# Altium schematic sheet MAGIsDebugger.SchDoc
size A4
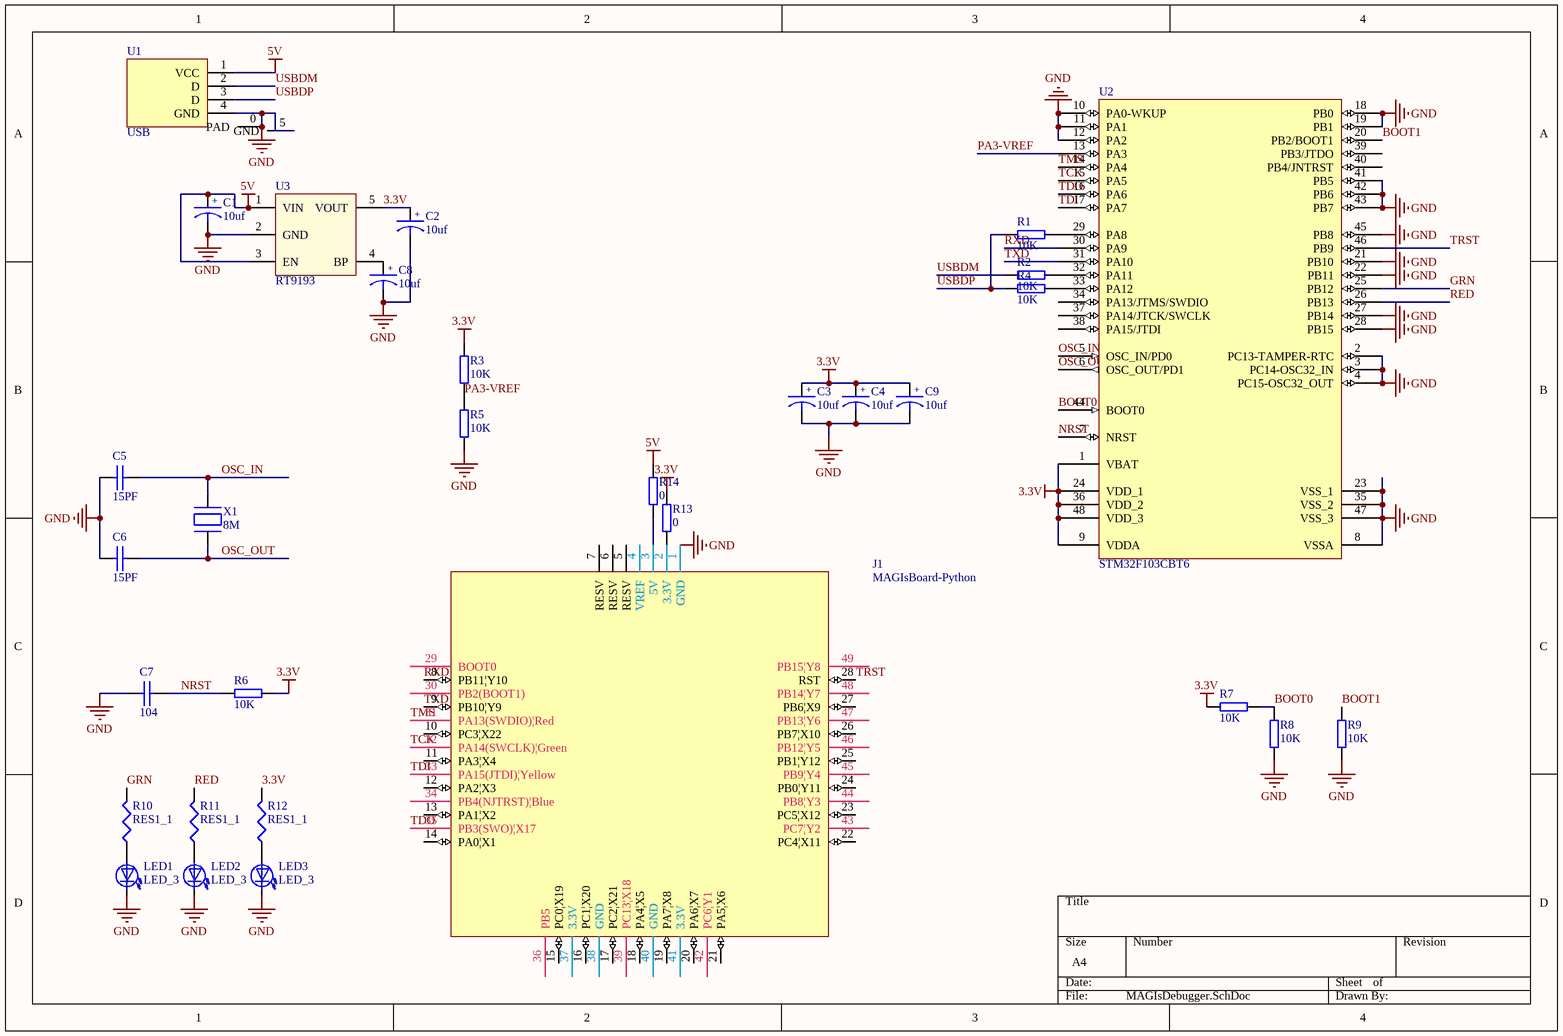
[diagram p0: MAGIsDebugger.SchDoc]

## Parts
C1  10uf  [6-0805_n]
C2  10uf  [6-0805_n]
C3  10uf  [6-0805_n]
C4  10uf  [6-0805_N]
C5  15PF  [6-0805_n]
C6  15PF  [6-0805_n]
C7  104  [6-0805_n]
C8  10uf  [6-0805_n]
C9  10uf  [6-0805_N]
J1  MAGIsBoard-Python  [MAGIsBoard-Python]
LED1  LED_3  [6-0805_n]
LED2  LED_3  [6-0805_n]
LED3  LED_3  [6-0805_n]
R1  10K  [6-0805_n]
R2  10K  [6-0805_n]
R3  10K  [6-0805_n]
R4  10K  [6-0805_n]
R5  10K  [6-0805_n]
R6  10K  [6-0805_n]
R7  10K  [6-0805_n]
R8  10K  [6-0805_n]
R9  10K  [6-0805_n]
R10  RES1_1  [6-0805_n]
R11  RES1_1  [6-0805_n]
R12  RES1_1  [6-0805_n]
R13  0  [6-0805_n]
R14  0  [6-0805_n]
U1  USB  [MicroUSB-B]
U2  STM32F103CBT6  [LQFP48_N]
U3  RT9193  [RT9193]
X1  8M  [5032]

## Nets
3.3V: C2.1 C3.1 C4.1 C9.1 R3.2 R6.2 R7.2 R12.2 R13.1 U2.1(VBAT) U2.9(VDDA) U2.24(VDD_1) U2.36(VDD_2) U2.48(VDD_3) U3.5(VOUT)
5V: C1.1 R14.1 U1.1(VCC) U3.1(VIN) U3.3(EN)
GND: C1.2 C2.2 C3.2 C4.2 C5.1 C6.1 C7.1 C8.2 C9.2 J1.1(GND) LED1.2(K) LED2.2(K) LED3.2(K) R5.1 R8.1 R9.1 U1.0(PAD) U1.4(GND) U1.5(GND) U2.2(PC13-TAMPER-RTC) U2.3(PC14-OSC32_IN) U2.4(PC15-OSC32_OUT) U2.8(VSSA) U2.10(PA0-WKUP) U2.11(PA1) U2.12(PA2) U2.18(PB0) U2.19(PB1) U2.21(PB10) U2.22(PB11) U2.23(VSS_1) U2.27(PB14) U2.28(PB15) U2.35(VSS_2) U2.41(PB5) U2.42(PB6) U2.43(PB7) U2.45(PB8) U2.47(VSS_3) U3.2(GND)
BOOT0: R7.1 R8.2 U2.44(BOOT0)
BOOT1: R9.2 U2.20(PB2/BOOT1)
GRN: R10.2 U2.25(PB12)
NRST: C7.2 R6.1 U2.7(NRST)
OSC_IN: C5.2 U2.5(OSC_IN/PD0) X1.1
OSC_OUT: C6.2 U2.6(OSC_OUT/PD1) X1.2
PA3-VREF: R3.1 R5.2 U2.13(PA3)
RED: R11.2 U2.26(PB13)
RXD: J1.8(PB11|Y10) U2.30(PA9)
TCK: J1.32(PA14(SWCLK)|Green) U2.15(PA5)
TDI: J1.33(PA15(JTDI)|Yellow) U2.17(PA7)
TDO: J1.35(PB3(SWO)|X17) U2.16(PA6)
TMS: J1.31(PA13(SWDIO)|Red) U2.14(PA4)
TRST: J1.28(RST) U2.46(PB9)
TXD: J1.9(PB10|Y9) U2.31(PA10)
USBDM: R2.1 U1.2(D)
USBDP: R1.1 R4.1 U1.3(D)
NetC8_1: C8.1 U3.4(BP)
NetJ1_2: J1.2(3.3V) R13.2
NetJ1_3: J1.3(5V) R14.2
NetLED1_1: LED1.1(A) R10.1
NetLED2_1: LED2.1(A) R11.1
NetLED3_1: LED3.1(A) R12.1
NetR1_2: R1.2 U2.29(PA8)
NetR2_2: R2.2 U2.32(PA11)
NetR4_2: R4.2 U2.33(PA12)

Not connected (* = marked no-connect by the designer): J1 4(VREF) 5(RESV) 6(RESV) 7(RESV) 10(PC3|X22) 11(PA3|X4) 12(PA2|X3) 13(PA1|X2) 14(PA0|X1) 15(PC0|X19) 16(PC1|X20) 17(PC2|X21) 18(PA4|X5) 19(PA7|X8) 20(PA6|X7) 21(PA5|X6) 22(PC4|X11) 23(PC5|X12) 24(PB0|Y11) 25(PB1|Y12) 26(PB7|X10) 27(PB6|X9) 29(BOOT0) 30(PB2(BOOT1)) 34(PB4(NJTRST)|Blue) 36(PB5) 37(3.3V) 38(GND) 39(PC13|X18) 40(GND) 41(3.3V) 42(PC6|Y1) 43(PC7|Y2) 44(PB8|Y3) 45(PB9|Y4) 46(PB12|Y5) 47(PB13|Y6) 48(PB14|Y7) 49(PB15|Y8); U2 34(PA13/JTMS/SWDIO) 37(PA14/JTCK/SWCLK) 38(PA15/JTDI) 39(PB3/JTDO) 40(PB4/JNTRST)

## Notes on the sheet
- (in symbol CAPACITOR POL) +

## Library data of the parts
C1-C4 C8 C9 = CAPACITOR POL: Capacitor
C5-C7 = CAP
R1-R9 R13 R14 = RES
U2 = STM32F103CBT6: STM32 ARM-based 32-bit MCU with 128 Kbytes Flash, 48-pin LQFP, Industrial Temperature; Published: 30-May-2008; DatasheetVersion: rev6, Mar-2008; PackageVersion: Mar-2008; PackageReference: LQFP48; Publisher: Altium Limited; PackageDescription: 48-Pin Low-Profile Quad Flat Pack, 7 x 7 mm Body, 0.5 mm Pitch (LQFP48); ComponentLink1Description: Manufacturer Link; ComponentLink1URL: www.st.com/stm32; ComponentLink2Description: Datasheet; ComponentLink2URL: http://www.st.com/stonline/products/literature/ds/13587.pdf
X1 = CRYSTAL